# Altium schematic sheet UART-FTDI-USB.SchDoc: UART to USB via FTDI
size A4; DrawnBy: Andrew Nicholson; Revision: 1
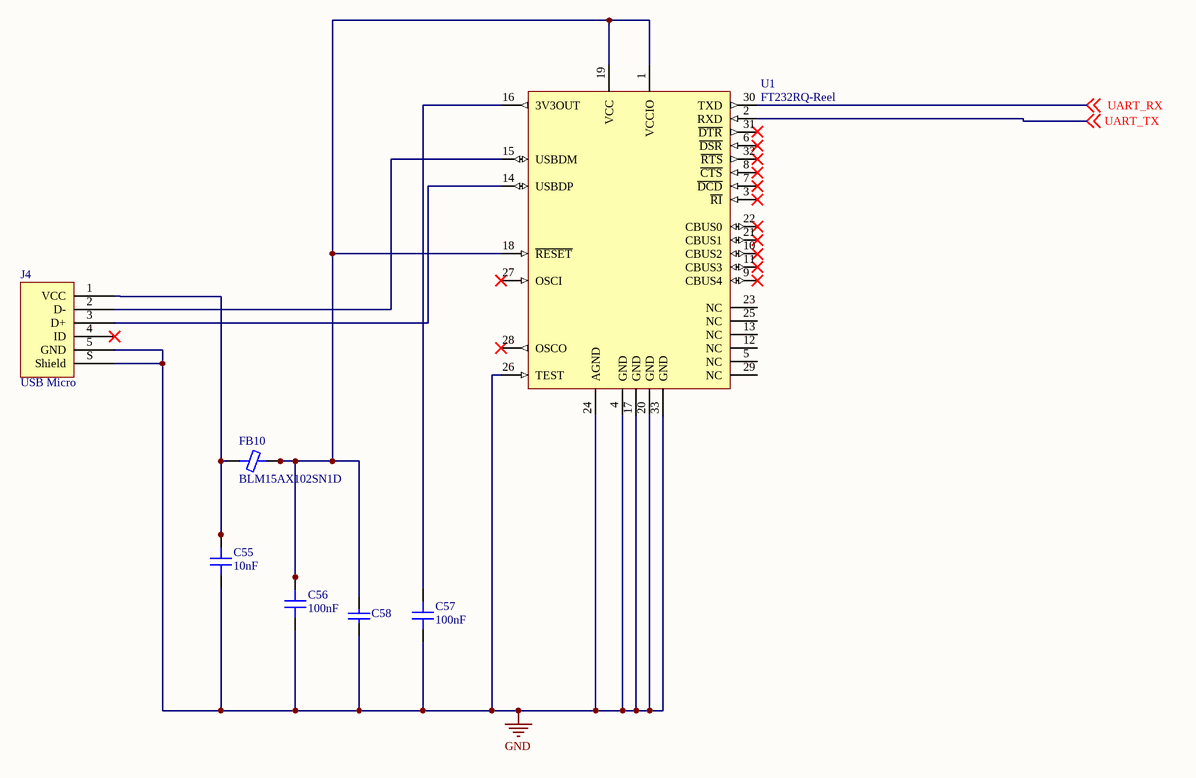
[diagram p0: UART-FTDI-USB.SchDoc]

## Parts
C55  10nF  [CAP 0402/1005]
C56  100nF  [CAP 0402/1005]
C57  100nF  [CAP 0402/1005]
C58  GRM155R60J475ME47D  [CAPC1005X55X25NL05T10]  (value not drawn)
FB10  BLM15AX102SN1D  [FER 0402/1005]
J4  USB Micro  [FCI USB 10118193-0001LF]
U1  FT232RQ-Reel  [PQFN5X5-32_V]

## Nets
GND: C55.1 C56.1 C57.1 C58.1 J4.5(GND) J4.S(Shield) U1.4(GND) U1.17(GND) U1.20(GND) U1.24(AGND) U1.26(TEST) U1.33(GND)
 UART_RX: U1.30(TXD) ; off-sheet  UART_RX
UART_TX: U1.2(RXD) ; off-sheet UART_TX
NetC55_2: C55.2 FB10.2 J4.1(VCC)
NetC56_2: C56.2 C58.2 FB10.1 U1.1(VCCIO) U1.18(~{RESET}) U1.19(VCC)
NetC57_2: C57.2 U1.16(3V3OUT)
NetJ4_2: J4.2(D-) U1.15(USBDM)
NetJ4_3: J4.3(D+) U1.14(USBDP)

Not connected (* = marked no-connect by the designer): J4 4(ID)*; U1 3(~{RI})* 5(NC) 6(~{DSR})* 7(~{DCD})* 8(~{CTS})* 9(CBUS4)* 10(CBUS2)* 11(CBUS3)* 12(NC) 13(NC) 21(CBUS1)* 22(CBUS0)* 23(NC) 25(NC) 27(OSCI)* 28(OSCO)* 29(NC) 31(~{DTR})* 32(~{RTS})*

## Library data of the parts
C55 = Capacitor: TAIYO YUDEN - TMK105B7103KV-F - CERAMIC CAPACITOR 0.01UF, 25V, X7R, 10%, 0402, FULL REEL; Supplier 1: Digi-Key; Supplier Part Number 1: 587-1223-1-ND; Manufacturer 1: Taiyo Yuden; Manufacturer Part Number 1: TMK105B7103KV-F; RoHS: Yes; Category: Ceramic Capacitors; Stock 1: 1448575; Pricing 1: 1=0.10000, 10=0.01700, 100=0.00780, 500=0.00554, 1000=0.00436, 2500=0.00396, 5000=0.00364 (USD); Mount: Surface Mount; Case/Package: 0402; Case Code (Metric): 1005; Case Code (Imperial): 0402; Contact Plating: Tin; Min Operating Temperature: -55°C; Max Operating Temperature: 125°C; Capacitance: 10nF; Tolerance: 10%; Package Quantity: 1; Voltage Rating: 25V; Packaging: Tape and Reel; Voltage Rating (DC): 25V; Dielectric: X7R; Termination: SMD/SMT; Composition: Ceramic; Voltage: 25V; Length: 1mm; Height: 0.5mm; Width: 0.02inch; Thickness: 0.022inch; Depth: 0.5mm; REACH SVHC: Unknown; Halogen Free: Halogen Free; ComponentLink1URL: https://datasheet.ciiva.com/129/tmk105b7103kv-f-ss-129699.pdf?src-supplier=Digi-Key; ComponentLink1Description: https://datasheet.ciiva.com/129/tmk105b7103kv-f-ss-129699.pdf?src-supplier=Digi-Key; ComponentLink2URL: https://datasheet.ciiva.com/30192/438tmk105b7103kv-f-30192315.pdf?src-supplier=Onlinecomponents.com; ComponentLink2Description: https://datasheet.ciiva.com/30192/438tmk105b7103kv-f-30192315.pdf?src-supplier=Onlinecomponents.com; ComponentLink3URL: https://datasheet.ciiva.com/15922/204tmk105b7103kv-f-15922348.pdf?src-supplier=Onlinecomponents.com; ComponentLink3Description: https://datasheet.ciiva.com/15922/204tmk105b7103kv-f-15922348.pdf?src-supplier=Onlinecomponents.com; ComponentLink4URL: https://datasheet.ciiva.com/30156/190tmk105b7103kv-f-30156174.pdf?src-supplier=Onlinecomponents.com; ComponentLink4Description: https://datasheet.ciiva.com/30156/190tmk105b7103kv-f-30156174.pdf?src-supplier=Onlinecomponents.com; ComponentLink5URL: https://datasheet.ciiva.com/7975/746258-7975835.pdf?src-supplier=Element14; ComponentLink5Description: https://datasheet.ciiva.com/7975/746258-7975835.pdf?src-supplier=Element14; ComponentLink6URL: https://datasheet.ciiva.com/28645/746258-28645254.pdf?src-supplier=Element14; ComponentLink6Description: https://datasheet.ciiva.com/28645/746258-28645254.pdf?src-supplier=Element14
C56 C57 = Capacitor: Cap Ceramic 0.1uF 10V X5R 20% Pad SMD 0402 85C T/R; Manufacturer 1: Samsung; Manufacturer Part Number 1: CL05A104MP5NNNC; Supplier 1: Digi-Key; Supplier Part Number 1: 1276-1443-1-ND; RoHS: Yes; Category: Ceramic Capacitors; Stock 1: 4686080; Pricing 1: 1=0.10000, 10=0.01900, 100=0.00830, 500=0.00592, 1000=0.00465, 2500=0.00422, 5000=0.00389 (USD); Mount: Surface Mount; Case/Package: 0402; Case Code (Metric): 1005; Case Code (Imperial): 0402; Min Operating Temperature: -55°C; Max Operating Temperature: 85°C; Packaging: Tape and Reel; Capacitance: 100nF; Tolerance: 20%; Voltage Rating: 10V; Dielectric: X5R; Voltage Rating (DC): 10V; Length: 1mm; Height: 0.5mm; Width: 0.02inch; Thickness: 0.022inch; Depth: 0.5mm; Radiation Hardening: No; Lead Free: Lead Free; ComponentLink1URL: https://datasheet.ciiva.com/25709/cl05a104mp5nnnc-25709105.pdf?src-supplier=Digi-Key; ComponentLink1Description: https://datasheet.ciiva.com/25709/cl05a104mp5nnnc-25709105.pdf?src-supplier=Digi-Key
C58 = CMP-2008-04549-1: Manufacturer: Murata; Part Number: GRM155R60J475ME47D
FB10 = Ferrite Chip: Ferrite Beads Multi-Layer 1KOhm 25% 100MHz 350mA 490mOhm DCR 0402 T/R; Manufacturer 1: Murata; Material: Ferrite,Steel; Impedance: 1kR; Number of Lines: 1; DC Resistance (DCR): 490mR; Supplier 1: Digi-Key; Supplier Part Number 1: 490-5442-1-ND; Manufacturer Part Number 1: BLM15AX102SN1D; RoHS: Yes; Category: Ferrite Beads and Chips; Stock 1: 214606; Pricing 1: 1=0.11000, 10=0.09000, 25=0.08120, 50=0.05960, 100=0.05140, 250=0.04060, 500=0.03428, 1000=0.02886, 5000=0.02571 (USD); Case/Package: 0402; Number of Pins: 2; Case Code (Metric): 1005; Case Code (Imperial): 0402; Min Operating Temperature: -55°C; Max Operating Temperature: 125°C; Package Quantity: 1; Tolerance: 25%; Packaging: Tape and Reel; Current Rating: 350mA; Max Current Rating: 350mA; Termination: SMD/SMT; Max DC Current: 350mA; Test Frequency: 100MHz; Number of Circuits: 1; Length: 1mm; Height: 0.5mm; Width: 0.5mm; Depth: 0.5mm; REACH SVHC: No SVHC; Lead Free: Lead Free; ComponentLink1URL: https://datasheet.ciiva.com/41425/001171674-da-01-en-chip-drossel0402-1000r-350ma-1-0x0-5mm-41425706.pdf?src-supplier=Conrad; ComponentLink1Description: https://datasheet.ciiva.com/41425/001171674-da-01-en-chip-drossel0402-1000r-350ma-1-0x0-5mm-41425706.pdf?src-supplier=Conrad; ComponentLink2URL: https://datasheet.ciiva.com/41449/001172166-da-01-en-drossel-0402-1000r-31-0x0-5mm-10000st-41449452.pdf?src-supplier=Conrad; ComponentLink2Description: https://datasheet.ciiva.com/41449/001172166-da-01-en-drossel-0402-1000r-31-0x0-5mm-10000st-41449452.pdf?src-supplier=Conrad; ComponentLink3URL: https://datasheet.ciiva.com/1012/l0110e-1012389.pdf?src-supplier=Digi-Key; ComponentLink3Description: https://datasheet.ciiva.com/1012/l0110e-1012389.pdf?src-supplier=Digi-Key; ComponentLink4URL: https://datasheet.ciiva.com/1012/l0110e-1012390.pdf?src-supplier=Digi-Key; ComponentLink4Description: https://datasheet.ciiva.com/1012/l0110e-1012390.pdf?src-supplier=Digi-Key; ComponentLink5URL: https://datasheet.ciiva.com/1012/l0110e-1012391.pdf?src-supplier=Digi-Key; ComponentLink5Description: https://datasheet.ciiva.com/1012/l0110e-1012391.pdf?src-supplier=Digi-Key; ComponentLink6URL: https://datasheet.ciiva.com/16420/l0110s0100blm15ax-sn-16420798.pdf?src-supplier=Future+Electronics; ComponentLink6Description: https://datasheet.ciiva.com/16420/l0110s0100blm15ax-sn-16420798.pdf?src-supplier=Future+Electronics
J4 = USB 2.0 Type B Micro: CONN RCPT USB2.0 MICRO B SMD R/A; Manufacturer 1: Amphenol FCI; Manufacturer Part Number 1: 10118193-0001LF; Gender: Female; Connector Type: USB,Receptacle; Number of Contacts: 5; Insulation Resistance: 1GR; Number of Ports: 1; Current Rating: 1.8A; Max Voltage Rating (AC): 100V; Pitch: 0.65mm; Supplier 1: Digi-Key; Supplier Part Number 1: 609-4616-1-ND; RoHS: Yes; Category: USB Connectors; Stock 1: 110752; Pricing 1: 1=0.43000, 10=0.40500, 25=0.36440, 50=0.32400, 100=0.31040, 250=0.28344, 500=0.26994 (USD); Mount: Surface Mount,Horizontal; Contact Material: Copper Alloy; Contact Plating: Gold; Color: Black; Number of Terminals: 5; Housing Material: Polymer; Min Operating Temperature: -55°C; Max Operating Temperature: 85°C; Termination: Solder; Orientation: Right Angle; Package Quantity: 1200; Packaging: Tape and Reel; Voltage Rating: 100V; Features: Shielded; Length: 7.86mm; Depth: 5.67mm; Radiation Hardening: No; Flammability Rating: UL94 V-0; ComponentLink1URL: https://datasheet.ciiva.com/851/10118193-851106.pdf?src-supplier=Digi-Key; ComponentLink1Description: https://datasheet.ciiva.com/851/10118193-851106.pdf?src-supplier=Digi-Key; ComponentLink2URL: https://datasheet.ciiva.com/14802/10118193-0001lf-webpage-14802386.pdf?src-supplier=Arrow; ComponentLink2Description: https://datasheet.ciiva.com/14802/10118193-0001lf-webpage-14802386.pdf?src-supplier=Arrow; ComponentLink3URL: https://datasheet.ciiva.com/26853/getdatasheetpartid-418618-26853893.pdf?src-supplier=Verical; ComponentLink3Description: https://datasheet.ciiva.com/26853/getdatasheetpartid-418618-26853893.pdf?src-supplier=Verical; ComponentLink4URL: https://datasheet.ciiva.com/4598/10118193ac-197151-4598799.pdf?src-supplier=Mouser; ComponentLink4Description: https://datasheet.ciiva.com/4598/10118193ac-197151-4598799.pdf?src-supplier=Mouser; ComponentLink5URL: https://datasheet.ciiva.com/851/10118193-851107.pdf?src-supplier=Digi-Key; ComponentLink5Description: https://datasheet.ciiva.com/851/10118193-851107.pdf?src-supplier=Digi-Key; ComponentLink6URL: https://datasheet.ciiva.com/851/10118193-851108.pdf?src-supplier=Digi-Key; ComponentLink6Description: https://datasheet.ciiva.com/851/10118193-851108.pdf?src-supplier=Digi-Key; ComponentLink7URL: https://datasheet.ciiva.com/14618/70236827-14618887.pdf?src-supplier=Allied+Electronics; ComponentLink7Description: https://datasheet.ciiva.com/14618/70236827-14618887.pdf?src-supplier=Allied+Electronics
U1 = CMP-0078-00009-3: USB UART Asynchronous Serial Data Transfer Chip, 32-pin QFN, Tape and Reel; Manufacturer: FTDI; ComponentLink1URL: http://www.ftdichip.com/; RevisionNote: DatasheetVersion updated to 2.10 Mar-2012; ComponentLink1Description: Manufacturer URL; PackageReference: PQFN5X5-32; PackageDescription: 32-Pin Quad Flat No-Lead 0.5 mm Pitch, Pullback, 3.2 x 3.2 mm Exposed Pad; DatasheetVersion: ver 2.10, Mar-2012; PartNumber: FT232RQ-Reel; ComponentLink2URL: http://www.ftdichip.com/Support/Documents/DataSheets/ICs/DS_FT232R.pdf; PackageVersion: Mar-12; ComponentLink2Description: Datasheet